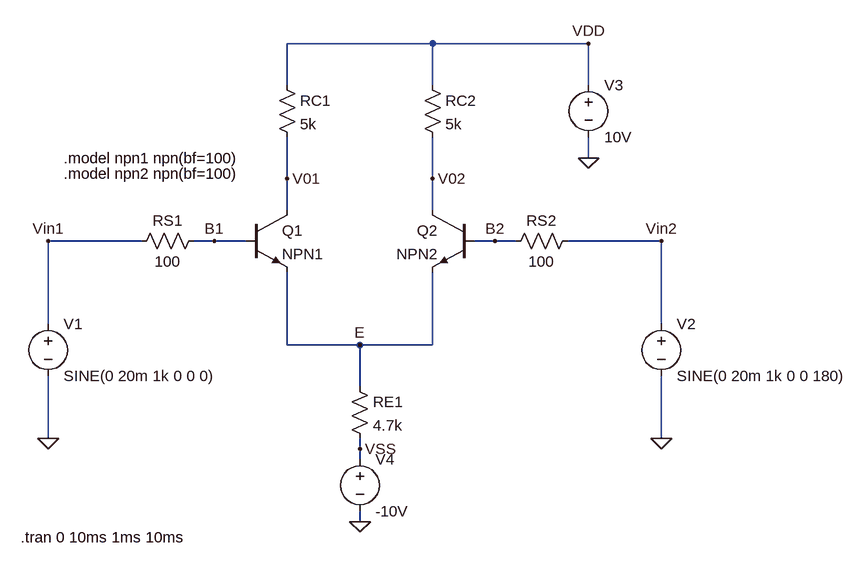
[diagram p0: schematic Draft52.asc]
Draft52.asc, the LTspice schematic file:
Version 4
SHEET 1 900 680
WIRE 240 -208 16 -208
WIRE 480 -208 240 -208
WIRE 16 -144 16 -208
WIRE 240 -144 240 -208
WIRE 480 -144 480 -208
WIRE 480 -32 480 -64
WIRE 16 0 16 -64
WIRE 240 0 240 -64
WIRE 16 48 16 0
WIRE 240 48 240 0
WIRE -208 96 -352 96
WIRE -96 96 -128 96
WIRE -48 96 -96 96
WIRE 336 96 304 96
WIRE 368 96 336 96
WIRE 592 96 448 96
WIRE -352 224 -352 96
WIRE 592 224 592 96
WIRE 16 256 16 144
WIRE 128 256 16 256
WIRE 240 256 240 144
WIRE 240 256 128 256
WIRE 128 320 128 256
WIRE -352 400 -352 304
WIRE 592 400 592 304
WIRE 128 416 128 400
WIRE 128 432 128 416
WIRE 128 528 128 512
FLAG -352 400 0
FLAG -96 96 B1
FLAG 16 0 V01
FLAG 592 400 0
FLAG 336 96 B2
FLAG 240 0 V02
FLAG 128 256 E
FLAG 480 -32 0
FLAG 128 528 0
FLAG 480 -208 VDD
FLAG 128 416 VSS
FLAG -352 96 Vin1
FLAG 592 96 Vin2
SYMBOL voltage -352 208 R0
WINDOW 123 0 0 Left 0
WINDOW 39 0 0 Left 0
SYMATTR InstName V1
SYMATTR Value SINE(0 20m 1k 0 0 0)
SYMBOL res -112 80 R90
WINDOW 0 0 56 VBottom 2
WINDOW 3 32 56 VTop 2
SYMATTR InstName RS1
SYMATTR Value 100
SYMBOL npn -48 48 R0
SYMATTR InstName Q1
SYMATTR Value NPN1
SYMBOL res 0 -160 R0
SYMATTR InstName RC1
SYMATTR Value 5k
SYMBOL voltage 592 208 R0
WINDOW 123 0 0 Left 0
WINDOW 39 0 0 Left 0
SYMATTR InstName V2
SYMATTR Value SINE(0 20m 1k 0 0 180)
SYMBOL res 464 80 R90
WINDOW 0 0 56 VBottom 2
WINDOW 3 32 56 VTop 2
SYMATTR InstName RS2
SYMATTR Value 100
SYMBOL npn 304 48 M0
SYMATTR InstName Q2
SYMATTR Value NPN2
SYMBOL res 224 -160 R0
SYMATTR InstName RC2
SYMATTR Value 5k
SYMBOL res 112 304 R0
SYMATTR InstName RE1
SYMATTR Value 4.7k
SYMBOL voltage 480 -160 R0
WINDOW 123 0 0 Left 0
WINDOW 39 0 0 Left 0
SYMATTR InstName V3
SYMATTR Value 10V
SYMBOL voltage 128 416 R0
WINDOW 123 0 0 Left 0
WINDOW 39 0 0 Left 0
SYMATTR InstName V4
SYMATTR Value -10V
TEXT -328 -32 Left 2 !.model npn1 npn(bf=100)
TEXT -328 -8 Left 2 !.model npn2 npn(bf=100)
TEXT -394 552 Left 2 !.tran 0 10ms 1ms 10ms

The netlist it stands for:
* Draft52.asc
V1 Vin1 0 SINE(0 20m 1k 0 0 0)
RS1 B1 Vin1 100
Q1 V01 B1 E 0 NPN1
RC1 VDD V01 5k
V2 Vin2 0 SINE(0 20m 1k 0 0 180)
RS2 Vin2 B2 100
Q2 V02 B2 E 0 NPN2
RC2 VDD V02 5k
RE1 E VSS 4.7k
V3 VDD 0 10V
V4 VSS 0 -10V
.model NPN NPN
.model PNP PNP
.lib standard.bjt
.model npn1 npn(bf=100)
.model npn2 npn(bf=100)
.tran 0 10ms 1ms 10ms
.backanno
.end